# EAGLE schematic ekspres_led (EAGLE 8.1.0)
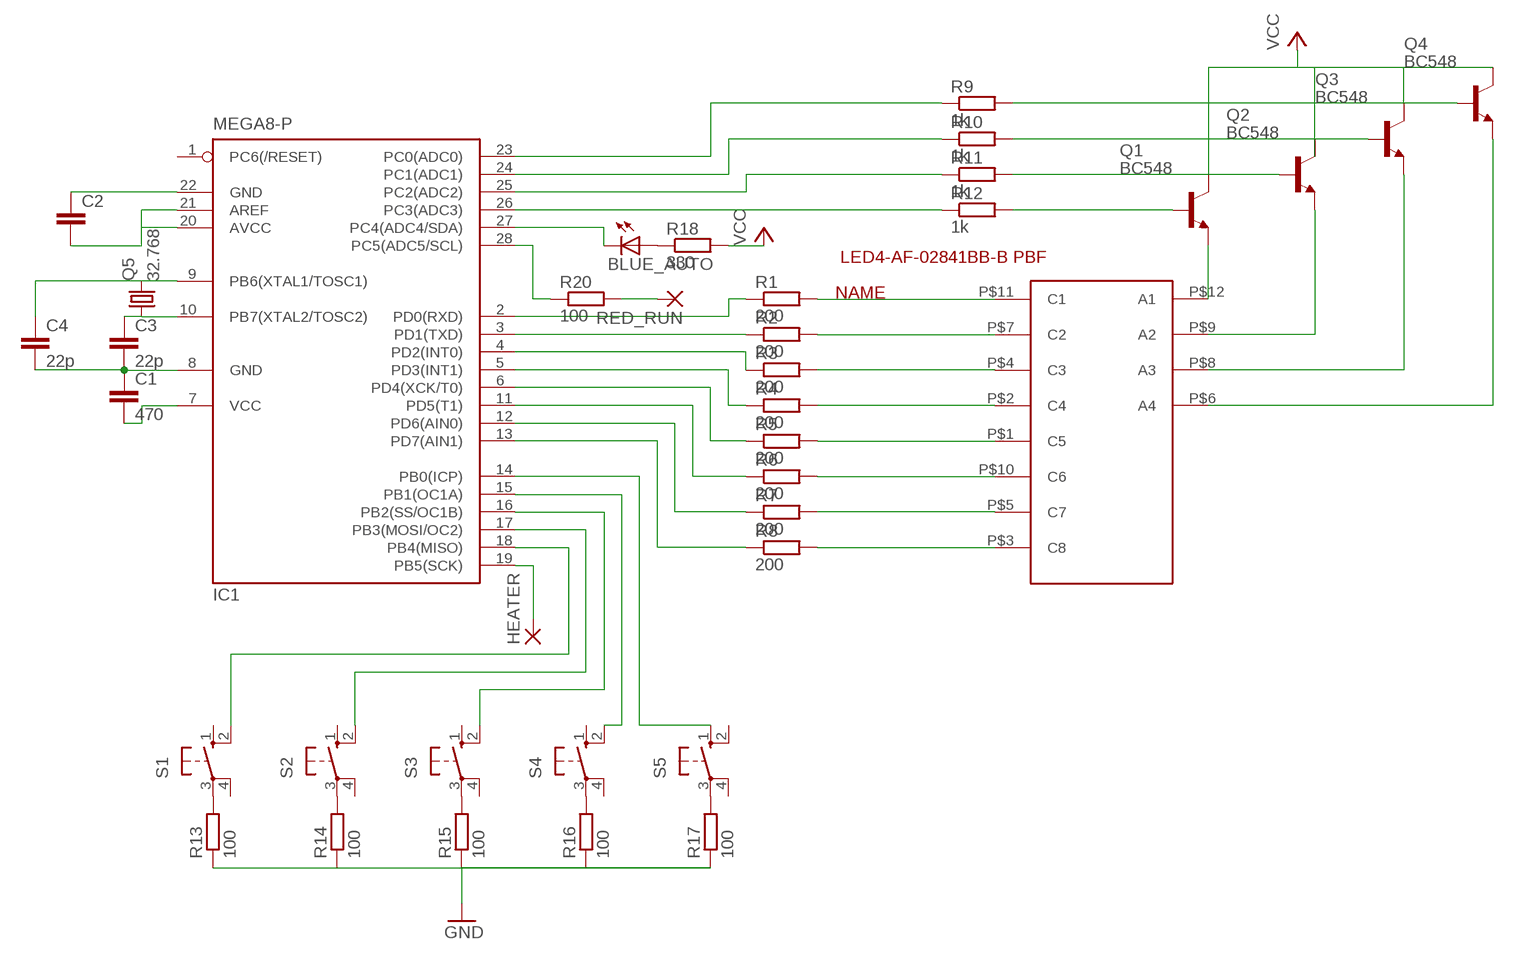
[diagram p0: schematic, sheet 1]

## Parts
BLUE_AUTO  LED5MM  [LED5MM]
C1  470  C-EU025-025X050  [C025-025X050]
C2  C-EU025-025X050  [C025-025X050]
C3  22p  C-EU025-025X050  [C025-025X050]
C4  22p  C-EU025-025X050  [C025-025X050]
DISPLAY  LED4-AF-02841BB-B  [LED4-AF-02841BB-B]
HEATER  1,6/0,8  [1,6/0,8]
IC1  MEGA8-P  [DIL28-3]
Q1  BC548  [TO92-EBC]
Q2  BC548  [TO92-EBC]
Q3  BC548  [TO92-EBC]
Q4  BC548  [TO92-EBC]
Q5  32.768  CRYSTALTC38H  [TC38H]
R1  200  R-EU_0204/7  [0204/7]
R2  200  R-EU_0204/7  [0204/7]
R3  200  R-EU_0204/7  [0204/7]
R4  200  R-EU_0204/7  [0204/7]
R5  200  R-EU_0204/7  [0204/7]
R6  200  R-EU_0204/7  [0204/7]
R7  200  R-EU_0204/7  [0204/7]
R8  200  R-EU_0204/7  [0204/7]
R9  1k  R-EU_0204/7  [0204/7]
R10  1k  R-EU_0204/7  [0204/7]
R11  1k  R-EU_0204/7  [0204/7]
R12  1k  R-EU_0204/7  [0204/7]
R13  100  R-EU_0204/5  [0204/5]
R14  100  R-EU_0204/5  [0204/5]
R15  100  R-EU_0204/5  [0204/5]
R16  100  R-EU_0204/5  [0204/5]
R17  100  R-EU_0204/5  [0204/5]
R18  330  R-EU_0204/7  [0204/7]
R20  100  R-EU_0204/7  [0204/7]
RED_RUN  1,6/0,8  [1,6/0,8]
S1  10-XX  [B3F-10XX]
S2  10-XX  [B3F-10XX]
S3  10-XX  [B3F-10XX]
S4  10-XX  [B3F-10XX]
S5  10-XX  [B3F-10XX]

## Nets
GND: C1.1 C2.1 C3.2 C4.2 IC1.8(GND) IC1.22(GND) R13.1 R14.1 R15.1 R16.1 R17.1
N$1: DISPLAY.P$11(C1) R1.2
N$2: DISPLAY.P$7(C2) R2.2
N$3: DISPLAY.P$4(C3) R3.2
N$4: DISPLAY.P$2(C4) R4.2
N$5: DISPLAY.P$1(C5) R5.2
N$6: DISPLAY.P$10(C6) R6.2
N$7: DISPLAY.P$5(C7) R7.2
N$8: DISPLAY.P$3(C8) R8.2
N$9: Q2.B R11.2
N$10: DISPLAY.P$12(A1) Q1.E
N$11: DISPLAY.P$9(A2) Q2.E
N$12: DISPLAY.P$6(A4) Q4.E
N$13: DISPLAY.P$8(A3) Q3.E
N$14: R13.2 S1.3(P)
N$15: Q4.B R9.2
N$16: Q3.B R10.2
N$17: Q1.B R12.2
N$18: C3.1 IC1.10(PB7(XTAL2/TOSC2)) Q5.1
N$19: C4.1 IC1.9(PB6(XTAL1/TOSC1)) Q5.2
N$20: R14.2 S2.3(P)
N$21: R15.2 S3.3(P)
N$22: R16.2 S4.3(P)
N$23: R17.2 S5.3(P)
N$24: IC1.2(PD0(RXD)) R1.1
N$25: IC1.3(PD1(TXD)) R2.1
N$26: IC1.4(PD2(INT0)) R3.1
N$27: IC1.5(PD3(INT1)) R4.1
N$28: IC1.6(PD4(XCK/T0)) R5.1
N$29: IC1.11(PD5(T1)) R6.1
N$30: IC1.12(PD6(AIN0)) R7.1
N$31: IC1.23(PC0(ADC0)) R9.1
N$32: IC1.24(PC1(ADC1)) R10.1
N$33: IC1.25(PC2(ADC2)) R11.1
N$34: IC1.26(PC3(ADC3)) R12.1
N$35: IC1.13(PD7(AIN1)) R8.1
N$36: IC1.14(PB0(ICP)) S5.1(S)
N$37: IC1.15(PB1(OC1A)) S4.2(S1)
N$38: IC1.16(PB2(SS/OC1B)) S3.2(S1)
N$39: IC1.17(PB3(MOSI/OC2)) S2.2(S1)
N$40: IC1.18(PB4(MISO)) S1.2(S1)
N$41: BLUE_AUTO.K(C) IC1.27(PC4(ADC4/SDA))
N$43: R20.2 RED_RUN.1(P)
N$44: BLUE_AUTO.A R18.1
N$46: IC1.28(PC5(ADC5/SCL)) R20.1
N$47: HEATER.1(P) IC1.19(PB5(SCK))
VCC: C1.2 C2.2 IC1.7(VCC) IC1.20(AVCC) IC1.21(AREF) Q1.C Q2.C Q3.C Q4.C R18.2
Unconnected: IC1.1(PC6(/RESET)) S1.1(S) S1.4(P1) S2.1(S) S2.4(P1) S3.1(S) S3.4(P1) S4.1(S) S4.4(P1) S5.2(S1) S5.4(P1)

## Library data of the parts
BLUE_AUTO = led:LED: LED OSRAM: - CHIPLED LG R971, LG N971, LY N971, LG Q971, LY Q971, LO R971, LY R971 LH N974, LH R974 LS Q976, LO Q976, LY Q976 LO Q996 - Hyper CHIPLED LW Q18S LB Q993, LB Q99A, LB R99A - SideLED LS A670, LO A670, LY A670, LG A670, LP A670 LB A673, LV A673, LT A673, LW A673 LH A674 LY A675 LS A676, LA A676, LO A676, LY A676, LW A676 LS A679, LY A679, LG A679 - Hyper Micro SIDELED® LS Y876, LA Y876, LO Y876, LY Y876 LT Y87S - SmartLED LW L88C, LW L88S LB L89C, LB L89S, LG L890 LS L89K, LO L89K, LY L89K LS L896, LA L896, LO L896, LY L896 - TOPLED LS T670, LO T670, LY T670, LG T670, LP T670 LSG T670, LSP T670, LSY T670, LOP T670, LYG T670 LG T671, LOG T671, LSG T671 LB T673, LV T673, LT T673, LW T673 LH T674 LS T676, LA T676, LO T676, LY T676, LB T676, LH T676, LSB T676, LW T676 LB T67C, LV T67C, LT T67C, LS T67K, LO T67K, LY T67K, LW E67C LS E67B, LA E67B, LO E67B, LY E67B, LB E67C, LV E67C, LT E67C LW T67C LS T679, LY T679, LG T679 LS T770, LO T770, LY T770, LG T770, LP T770 LB T773, LV T773, LT T773, LW T773 LH T774 LS E675, LA E675, LY E675, LS T675 LS T776, LA T776, LO T776, LY T776, LB T776 LHGB T686 LT T68C, LB T68C - Hyper Mini TOPLED® LB M676 - Mini TOPLED Santana® LG M470 LS M47K, LO M47K, LY M47K Source: http://www.osram.convergy.de LUXEON: - LUMILED® LXK2-PW12-R00, LXK2-PW12-S00, LXK2-PW14-U00, LXK2-PW14-V00 LXK2-PM12-R00, LXK2-PM12-S00, LXK2-PM14-U00 LXK2-PE12-Q00, LXK2-PE12-R00, LXK2-PE12-S00, LXK2-PE14-T00, LXK2-PE14-U00 LXK2-PB12-K00, LXK2-PB12-L00, LXK2-PB12-M00, LXK2-PB14-N00, LXK2-PB14-P00, LXK2-PB14-Q00 LXK2-PR12-L00, LXK2-PR12-M00, LXK2-PR14-Q00, LXK2-PR14-R00 LXK2-PD12-Q00, LXK2-PD12-R00, LXK2-PD12-S00 LXK2-PH12-R00, LXK2-PH12-S00 LXK2-PL12-P00, LXK2-PL12-Q00, LXK2-PL12-R00 Source: www.luxeon.com KINGBRIGHT: KA-3528ASYC Source: www.kingbright.com
C1-C4 = rcl:C-EU: CAPACITOR, European symbol
DISPLAY = LED-7-segment-atronic:LED4-AF-02841BB-B
HEATER RED_RUN = wirepad:1,6/0,8: THROUGH-HOLE PAD
IC1 = atmel:MEGA8-P: MICROCONTROLLER 8 Kbytes FLASH, 1 kbytes SRAM, 512 bytes EEPROM, USART, 4-channel 10 bit ADC, 2-channel 8 bit ADC Pin compatible with Atmega48, ATMega88, ATMega168 Source: avr.lbr; OC_FARNELL: unknown; OC_NEWARK: unknown
Q1-Q4 = transistor-npn:BC548*: NPN Transistor
Q5 = crystal:CRYSTAL: CRYSTAL; OC_FARNELL: unknown; OC_NEWARK: unknown
R1-R18 R20 = rcl:R-EU_: RESISTOR, European symbol
S1-S5 = switch-omron:10-XX: OMRON SWITCH; MPN: B3F-1000; OC_FARNELL: 176432; OC_NEWARK: 36M3542